# Altium schematic sheet Ring 2_B.SchDoc
size A; DocumentNumber: 8; SheetNumber: 12; SheetTotal: 30
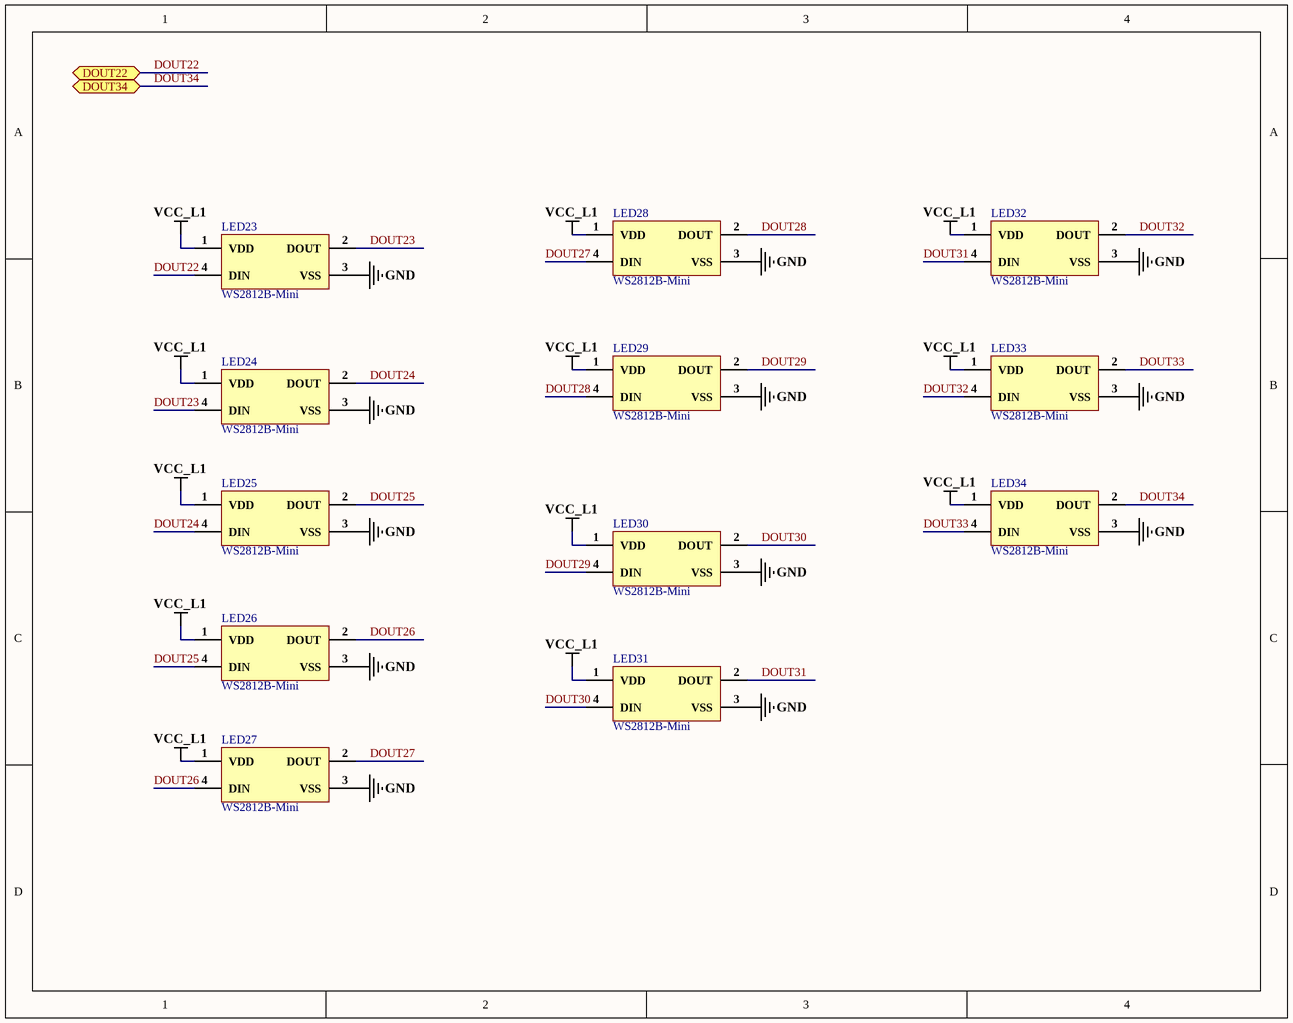
[diagram p0: Ring 2_B.SchDoc]

## Parts
LED23  WS2812B-Mini  [WS2812B-Mini]
LED24  WS2812B-Mini  [WS2812B-Mini]
LED25  WS2812B-Mini  [WS2812B-Mini]
LED26  WS2812B-Mini  [WS2812B-Mini]
LED27  WS2812B-Mini  [WS2812B-Mini]
LED28  WS2812B-Mini  [WS2812B-Mini]
LED29  WS2812B-Mini  [WS2812B-Mini]
LED30  WS2812B-Mini  [WS2812B-Mini]
LED31  WS2812B-Mini  [WS2812B-Mini]
LED32  WS2812B-Mini  [WS2812B-Mini]
LED33  WS2812B-Mini  [WS2812B-Mini]
LED34  WS2812B-Mini  [WS2812B-Mini]

## Ports
DOUT22 (bidir), DOUT34 (bidir)

## Nets
GND: LED23.3(VSS) LED24.3(VSS) LED25.3(VSS) LED26.3(VSS) LED27.3(VSS) LED28.3(VSS) LED29.3(VSS) LED30.3(VSS) LED31.3(VSS) LED32.3(VSS) LED33.3(VSS) LED34.3(VSS)
VCC_L1: LED23.1(VDD) LED24.1(VDD) LED25.1(VDD) LED26.1(VDD) LED27.1(VDD) LED28.1(VDD) LED29.1(VDD) LED30.1(VDD) LED31.1(VDD) LED32.1(VDD) LED33.1(VDD) LED34.1(VDD)
DOUT22: LED23.4(DIN) ; port DOUT22
DOUT23: LED23.2(DOUT) LED24.4(DIN)
DOUT24: LED24.2(DOUT) LED25.4(DIN)
DOUT25: LED25.2(DOUT) LED26.4(DIN)
DOUT26: LED26.2(DOUT) LED27.4(DIN)
DOUT27: LED27.2(DOUT) LED28.4(DIN)
DOUT28: LED28.2(DOUT) LED29.4(DIN)
DOUT29: LED29.2(DOUT) LED30.4(DIN)
DOUT30: LED30.2(DOUT) LED31.4(DIN)
DOUT31: LED31.2(DOUT) LED32.4(DIN)
DOUT32: LED32.2(DOUT) LED33.4(DIN)
DOUT33: LED33.2(DOUT) LED34.4(DIN)
DOUT34: LED34.2(DOUT) ; port DOUT34

## Library data of the parts
LED23-LED34 = WS2812B-Mini: SMD,3.5x3.5mm Light Emitting Diodes (LED) RoHS; Manufacturer: Worldsemi; ComponentLink1Description: LCSC; ComponentLink1URL: *https://lcsc.com/product-detail/Light-Emitting-Diodes-LED_Worldsemi-WS2812B-Mini_C527089.html; Package: SMD,3.5x3.5mm; Parameter 1: *